# Altium schematic sheet 01-LED.SchDoc
size A4
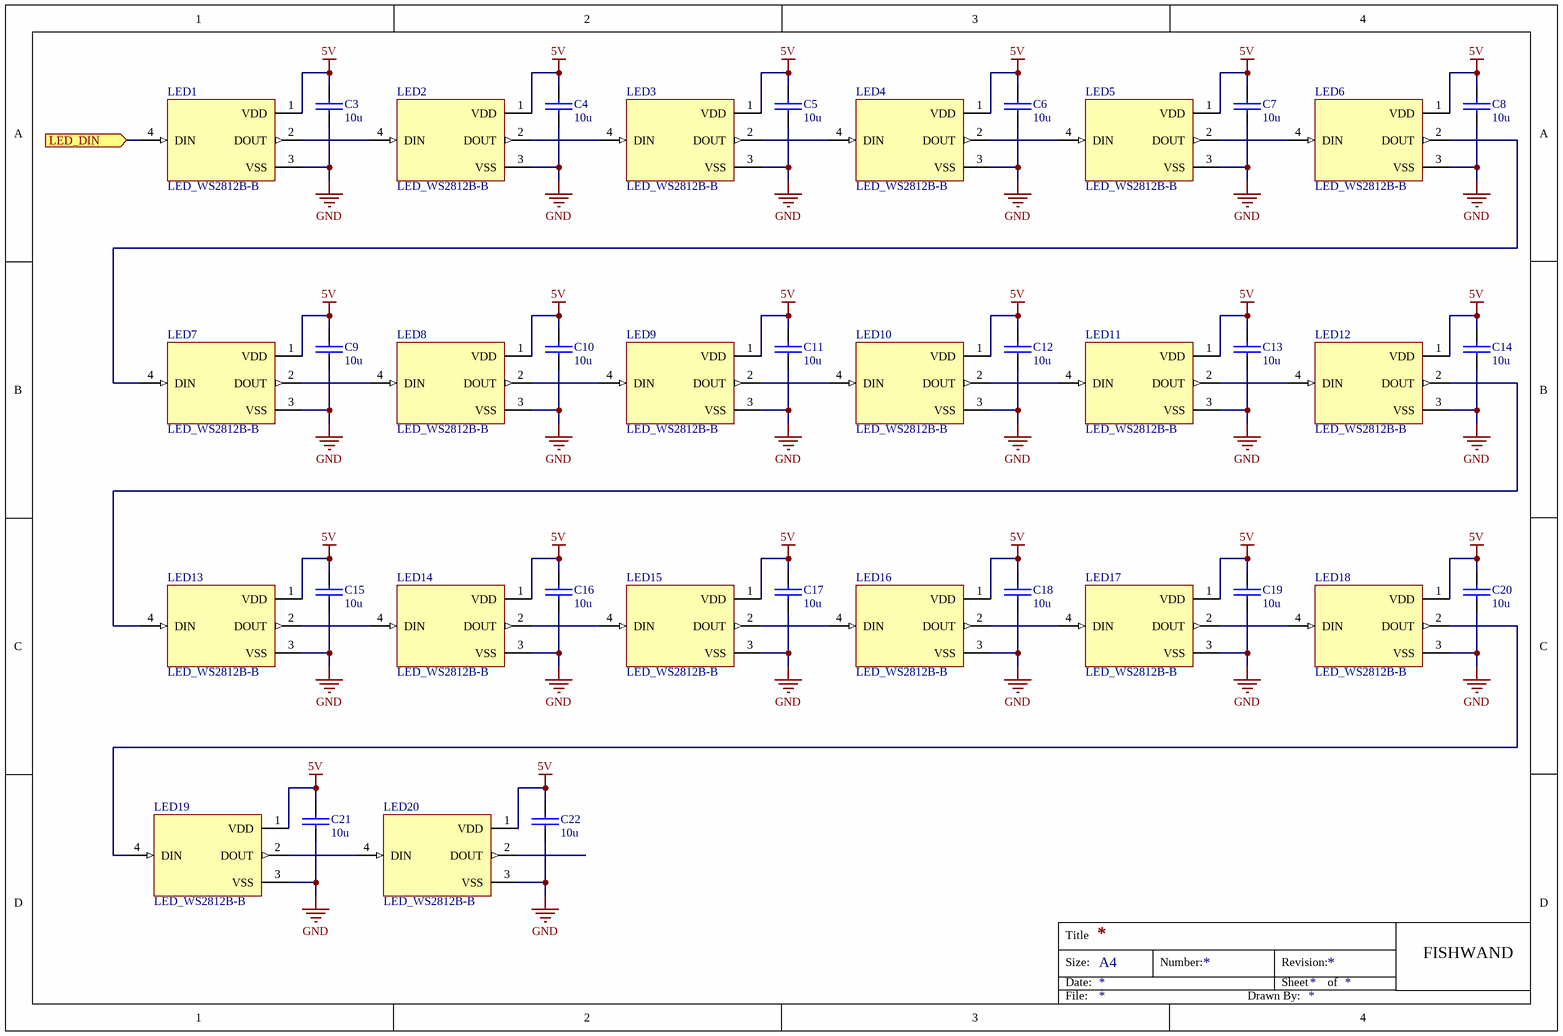
[diagram p0: 01-LED.SchDoc]

## Parts
C3  10u  [CAPC100X50X65]
C4  10u  [CAPC100X50X65]
C5  10u  [CAPC100X50X65]
C6  10u  [CAPC100X50X65]
C7  10u  [CAPC100X50X65]
C8  10u  [CAPC100X50X65]
C9  10u  [CAPC100X50X65]
C10  10u  [CAPC100X50X65]
C11  10u  [CAPC100X50X65]
C12  10u  [CAPC100X50X65]
C13  10u  [CAPC100X50X65]
C14  10u  [CAPC100X50X65]
C15  10u  [CAPC100X50X65]
C16  10u  [CAPC100X50X65]
C17  10u  [CAPC100X50X65]
C18  10u  [CAPC100X50X65]
C19  10u  [CAPC100X50X65]
C20  10u  [CAPC100X50X65]
C21  10u  [CAPC100X50X65]
C22  10u  [CAPC100X50X65]
LED1  LED_WS2812B-B  [LED_WS2812B-B]
LED2  LED_WS2812B-B  [LED_WS2812B-B]
LED3  LED_WS2812B-B  [LED_WS2812B-B]
LED4  LED_WS2812B-B  [LED_WS2812B-B]
LED5  LED_WS2812B-B  [LED_WS2812B-B]
LED6  LED_WS2812B-B  [LED_WS2812B-B]
LED7  LED_WS2812B-B  [LED_WS2812B-B]
LED8  LED_WS2812B-B  [LED_WS2812B-B]
LED9  LED_WS2812B-B  [LED_WS2812B-B]
LED10  LED_WS2812B-B  [LED_WS2812B-B]
LED11  LED_WS2812B-B  [LED_WS2812B-B]
LED12  LED_WS2812B-B  [LED_WS2812B-B]
LED13  LED_WS2812B-B  [LED_WS2812B-B]
LED14  LED_WS2812B-B  [LED_WS2812B-B]
LED15  LED_WS2812B-B  [LED_WS2812B-B]
LED16  LED_WS2812B-B  [LED_WS2812B-B]
LED17  LED_WS2812B-B  [LED_WS2812B-B]
LED18  LED_WS2812B-B  [LED_WS2812B-B]
LED19  LED_WS2812B-B  [LED_WS2812B-B]
LED20  LED_WS2812B-B  [LED_WS2812B-B]

## Ports
LED_DIN (in)

## Nets
5V: C3.1 C4.1 C5.1 C6.1 C7.1 C8.1 C9.1 C10.1 C11.1 C12.1 C13.1 C14.1 C15.1 C16.1 C17.1 C18.1 C19.1 C20.1 C21.1 C22.1 LED1.1(VDD) LED2.1(VDD) LED3.1(VDD) LED4.1(VDD) LED5.1(VDD) LED6.1(VDD) LED7.1(VDD) LED8.1(VDD) LED9.1(VDD) LED10.1(VDD) LED11.1(VDD) LED12.1(VDD) LED13.1(VDD) LED14.1(VDD) LED15.1(VDD) LED16.1(VDD) LED17.1(VDD) LED18.1(VDD) LED19.1(VDD) LED20.1(VDD)
GND: C3.2 C4.2 C5.2 C6.2 C7.2 C8.2 C9.2 C10.2 C11.2 C12.2 C13.2 C14.2 C15.2 C16.2 C17.2 C18.2 C19.2 C20.2 C21.2 C22.2 LED1.3(VSS) LED2.3(VSS) LED3.3(VSS) LED4.3(VSS) LED5.3(VSS) LED6.3(VSS) LED7.3(VSS) LED8.3(VSS) LED9.3(VSS) LED10.3(VSS) LED11.3(VSS) LED12.3(VSS) LED13.3(VSS) LED14.3(VSS) LED15.3(VSS) LED16.3(VSS) LED17.3(VSS) LED18.3(VSS) LED19.3(VSS) LED20.3(VSS)
LED_DIN: LED1.4(DIN) ; port LED_DIN
NetLED1_2: LED1.2(DOUT) LED2.4(DIN)
NetLED2_2: LED2.2(DOUT) LED3.4(DIN)
NetLED3_2: LED3.2(DOUT) LED4.4(DIN)
NetLED4_2: LED4.2(DOUT) LED5.4(DIN)
NetLED5_2: LED5.2(DOUT) LED6.4(DIN)
NetLED6_2: LED6.2(DOUT) LED7.4(DIN)
NetLED7_2: LED7.2(DOUT) LED8.4(DIN)
NetLED8_2: LED8.2(DOUT) LED9.4(DIN)
NetLED9_2: LED9.2(DOUT) LED10.4(DIN)
NetLED10_2: LED10.2(DOUT) LED11.4(DIN)
NetLED11_2: LED11.2(DOUT) LED12.4(DIN)
NetLED12_2: LED12.2(DOUT) LED13.4(DIN)
NetLED13_2: LED13.2(DOUT) LED14.4(DIN)
NetLED14_2: LED14.2(DOUT) LED15.4(DIN)
NetLED15_2: LED15.2(DOUT) LED16.4(DIN)
NetLED16_2: LED16.2(DOUT) LED17.4(DIN)
NetLED17_2: LED17.2(DOUT) LED18.4(DIN)
NetLED18_2: LED18.2(DOUT) LED19.4(DIN)
NetLED19_2: LED19.2(DOUT) LED20.4(DIN)

Not connected (* = marked no-connect by the designer): LED20 2(DOUT)

## Notes on the sheet
- Title
- Size:
- Date:
- A4
- Number:
- Revision:
- Sheet
- of
- FISHWAND
- File:
- Drawn By:

## Library data of the parts
C3-C22 = C_10UF_10V_X5R_0402: CAP CER 10UF 10V X5R 0402; Manufacturer: Samsung Electro-Mechanics; Manufacturer PN: CL05A106MP5NUNC; Supplier PN: 1276-1450-1-ND
LED1-LED20 = LED_WS2812B-B: Intelligent control LED integrated light source; Manufacturer PN: WS2812B-V5; Manufacturer: Worldsemi; Package / Case: 5050; Value: *; Price: None; Availability: Unavailable